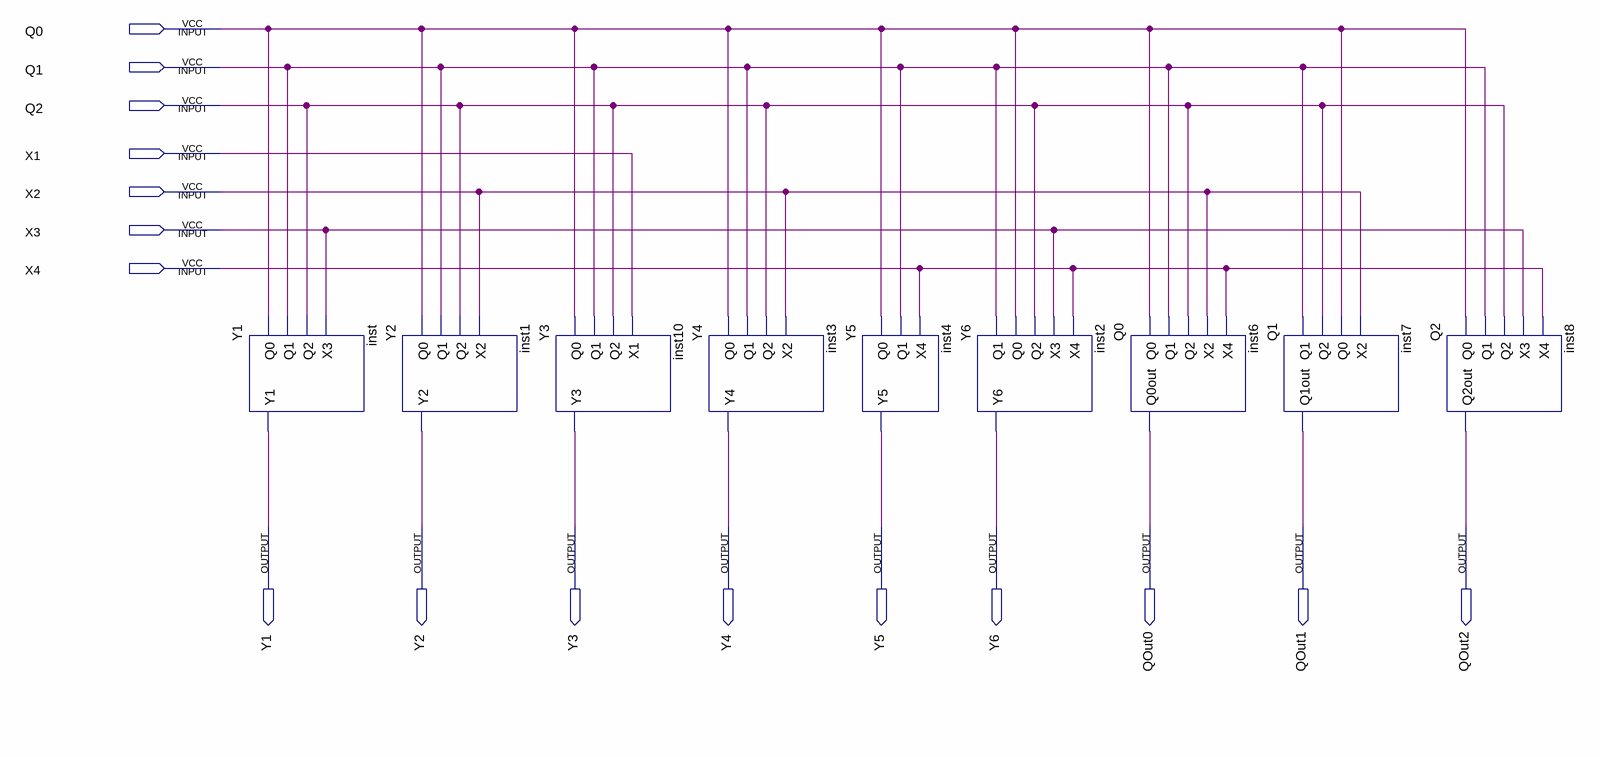
[diagram p0: schematic sheet]
// Quartus schematic decoder.bdf as structural Verilog: 9 symbols, 16 pins
module decoder (
  input  Q0,
  input  Q1,
  input  Q2,
  input  X1,
  input  X2,
  input  X3,
  input  X4,
  output Y1,
  output Y2,
  output Y3,
  output Y4,
  output Y5,
  output Y6,
  output QOut0,
  output QOut1,
  output QOut2
);

  Y1 inst (.Q0(Q0), .Q1(Q1), .Q2(Q2), .X3(X3), .Y1(Y1));
  Y2 inst1 (.Q0(Q0), .Q1(Q1), .Q2(Q2), .X2(X2), .Y2(Y2));
  Y3 inst10 (.Q0(Q0), .Q1(Q1), .Q2(Q2), .X1(X1), .Y3(Y3));
  Y4 inst3 (.Q0(Q0), .Q1(Q1), .Q2(Q2), .X2(X2), .Y4(Y4));
  Y5 inst4 (.Q0(Q0), .Q1(Q1), .X4(X4), .Y5(Y5));
  Y6 inst2 (.Q1(Q1), .Q0(Q0), .Q2(Q2), .X3(X3), .X4(X4), .Y6(Y6));
  Q0 inst6 (.Q0(Q0), .Q1(Q1), .Q2(Q2), .X2(X2), .X4(X4), .Q0out(QOut0));
  Q1 inst7 (.Q1(Q1), .Q2(Q2), .Q0(Q0), .X2(X2), .Q1out(QOut1));
  Q2 inst8 (.Q0(Q0), .Q1(Q1), .Q2(Q2), .X3(X3), .X4(X4), .Q2out(QOut2));
endmodule
